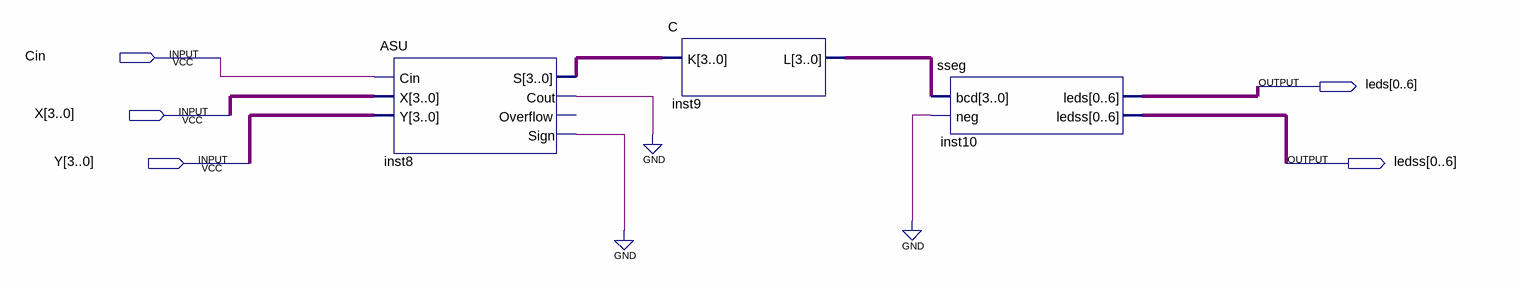
[diagram p0: schematic sheet]
// Quartus schematic CombinedASU2.bdf as structural Verilog: 3 symbols, 5 pins
module CombinedASU2 (
  input  Cin,
  input  [3:0] X,
  input  [3:0] Y,
  output [0:6] leds,
  output [0:6] ledss
);

  wire inst8_cout, inst8_sign;
  wire [3:0] inst8_s, inst9_l;

  ASU inst8 (.Cin(Cin), .X(X), .Y(Y), .S(inst8_s), .Cout(inst8_cout), .Sign(inst8_sign));  // open: Overflow
  C inst9 (.K(inst8_s), .L(inst9_l));
  sseg inst10 (.bcd(inst9_l), .neg(1'b0), .leds(leds), .ledss(ledss));
  // also tied to GND on the sheet: {inst8_cout, inst8_sign}
endmodule
